# Altium schematic sheet [15]-MAIN_CONNECTORS.SchDoc
size A4
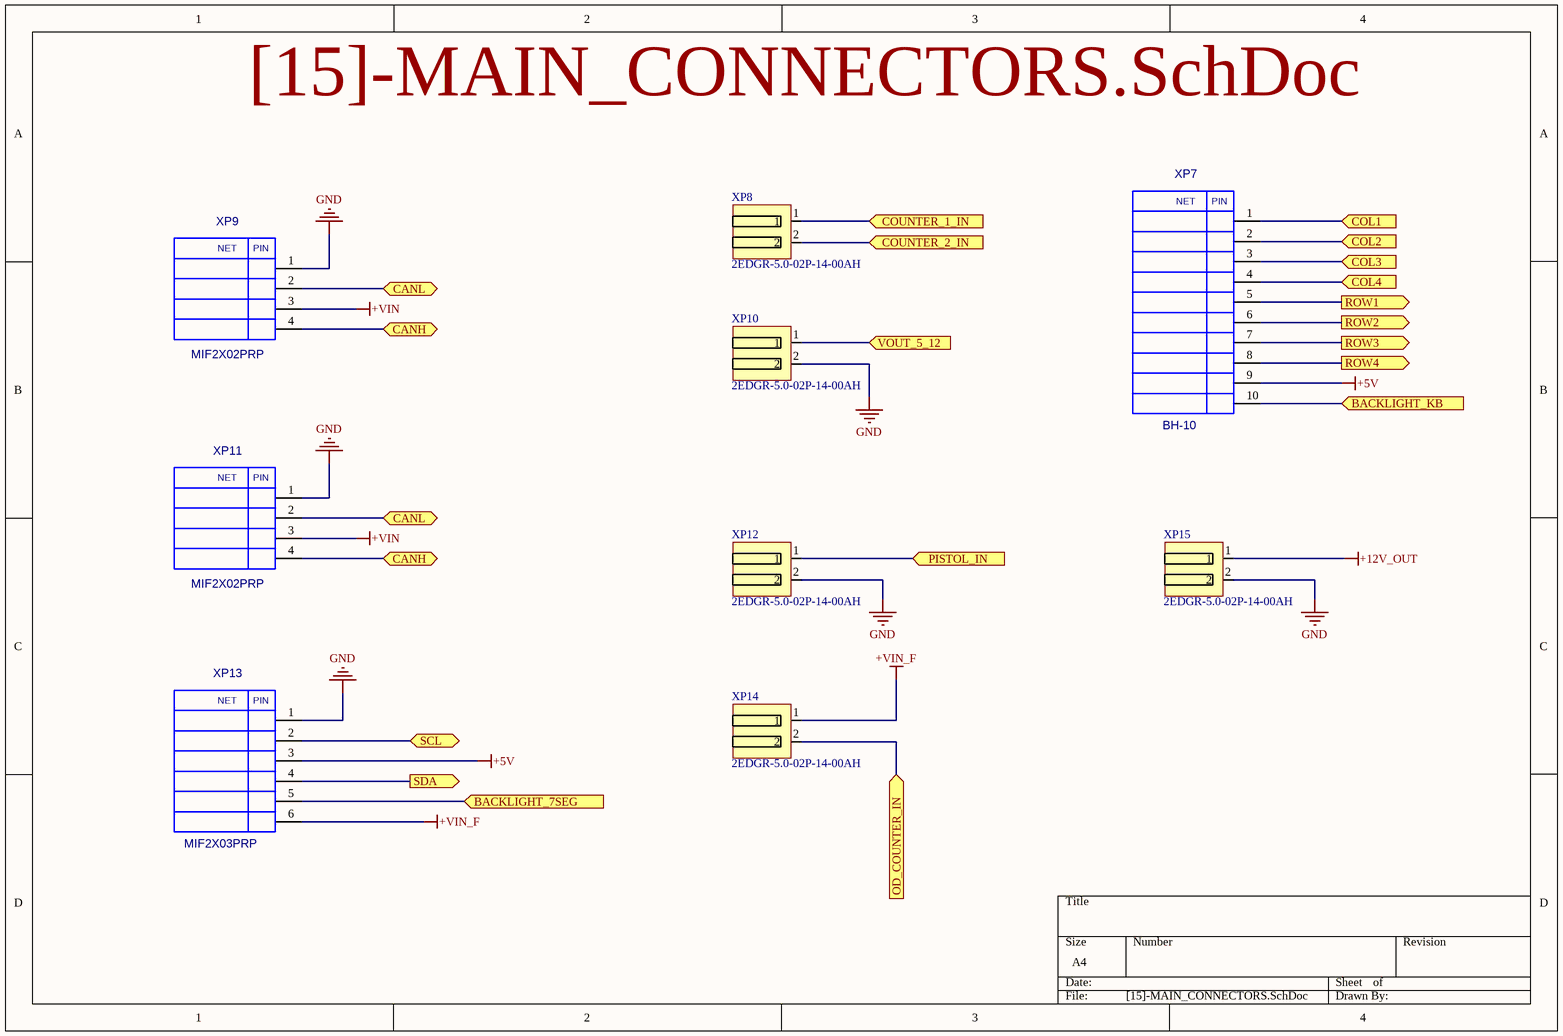
[diagram p0: [15]-MAIN_CONNECTORS.SchDoc]

## Parts
XP7  BH-10  [BH-10]
XP8  2EDGR-5.0-02P-14-00AH  [2EDGR-5.0]
XP9  MIF2X02PRP  [MIF2X02PRP]
XP10  2EDGR-5.0-02P-14-00AH  [2EDGR-5.0]
XP11  MIF2X02PRP  [MIF2X02PRP]
XP12  2EDGR-5.0-02P-14-00AH  [2EDGR-5.0]
XP13  MIF2X03PRP  [MIF2X03PRP]
XP14  2EDGR-5.0-02P-14-00AH  [2EDGR-5.0]
XP15  2EDGR-5.0-02P-14-00AH  [2EDGR-5.0]

## Ports
BACKLIGHT_7SEG (in), BACKLIGHT_KB (in), CANH (bidir), CANL (bidir), COL1 (in), COL2 (in), COL3 (in), COL4 (in), COUNTER_1_IN (in), COUNTER_2_IN (in), OD_COUNTER_IN (in), PISTOL_IN (in), ROW1 (out), ROW2 (out), ROW3 (out), ROW4 (out), SCL (bidir), SDA (out), VOUT_5_12 (in)

## Nets
+5V: XP7.9 XP13.3
+12V_OUT: XP15.1
+VIN: XP9.3 XP11.3
+VIN_F: XP13.6 XP14.1
GND: XP9.1 XP10.2 XP11.1 XP12.2 XP13.1 XP15.2
BACKLIGHT_7SEG: XP13.5 ; port BACKLIGHT_7SEG
BACKLIGHT_KB: XP7.10 ; port BACKLIGHT_KB
CANH: XP9.4 XP11.4 ; port CANH
CANL: XP9.2 XP11.2 ; port CANL
COL1: XP7.1 ; port COL1
COL2: XP7.2 ; port COL2
COL3: XP7.3 ; port COL3
COL4: XP7.4 ; port COL4
COUNTER_1_IN: XP8.1 ; port COUNTER_1_IN
COUNTER_2_IN: XP8.2 ; port COUNTER_2_IN
OD_COUNTER_IN: XP14.2 ; port OD_COUNTER_IN
PISTOL_IN: XP12.1 ; port PISTOL_IN
ROW1: XP7.5 ; port ROW1
ROW2: XP7.6 ; port ROW2
ROW3: XP7.7 ; port ROW3
ROW4: XP7.8 ; port ROW4
SCL: XP13.2 ; port SCL
SDA: XP13.4 ; port SDA
VOUT_5_12: XP10.1 ; port VOUT_5_12

## Notes on the sheet
- (in symbol BH-10) NET; PIN
- (in symbol MIF2X02PRP) NET; PIN
- (in symbol MIF2X03PRP) NET; PIN

## Library data of the parts
XP7 = BH-10: Value: *
XP8 XP10 XP12 XP14 XP15 = 2EDGR-5.0-02P-14-00AH: Value: 2EDGR-5.0-02P-14-00AH
XP9 XP11 = MIF2X02PRP: Value: *
XP13 = MIF2X03PRP: Value: *